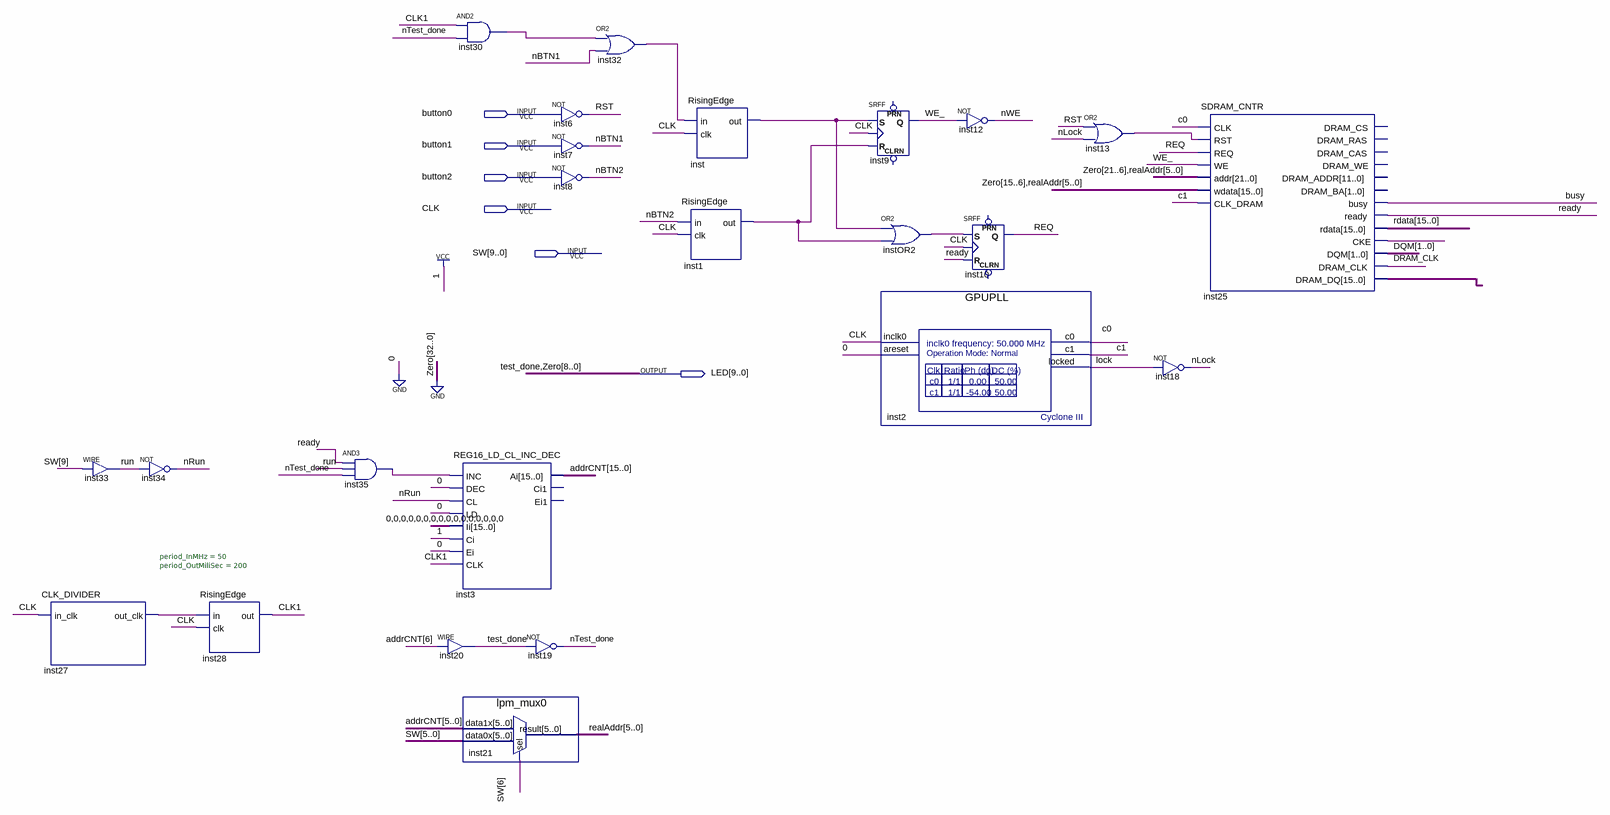
[diagram p0: schematic sheet]
// Quartus schematic sdram_test.bdf as structural Verilog: 24 symbols, 6 pins
module sdram_test (
  input  button0,
  input  button1,
  input  button2,
  input  CLK,
  input  [9:0] SW,
  output [9:0] LED
);

  wire busy, c0, c1, CLK1, DRAM_CLK, inst1_out, inst13_out, inst25_cke, inst27_out_clk, inst30_out,
       inst32_out, inst35_out, inst_out, instOR2_out, lock, nBTN1, nBTN2, nLock, nRun, nTest_done, nWE,
       ready, REQ, RST, run, WE_;
  wire [1:0] DQM;
  wire [5:0] realAddr;
  wire [15:0] addrCNT, inst25_dram_dq, rdata;

  CLK_DIVIDER #(.period_InMHz(50), .period_OutMiliSec(200)) inst27 (.in_clk(CLK), .out_clk(inst27_out_clk));
  assign run = SW[9];  // WIRE inst33
  not inst34 (nRun, run);
  RisingEdge inst28 (.in(inst27_out_clk), .clk(CLK), .out(CLK1));
  and inst35 (inst35_out, ready, run, nTest_done);
  and inst30 (inst30_out, CLK1, nTest_done);
  REG16_LD_CL_INC_DEC inst3 (
    .INC(inst35_out), .DEC(1'b0), .CL(nRun), .LD(1'b0), .Ii({16{1'b0}}), .Ci(1'b1), .Ei(1'b0), .CLK(CLK1),
    .Ai(addrCNT));  // open: Ci1, Ei1
  assign LED[9] = addrCNT[6];  // WIRE inst20
  lpm_mux0 inst21 (.data1x(addrCNT[5:0]), .data0x(SW[5:0]), .sel(SW[6]), .result(realAddr));
  not inst6 (RST, button0);
  not inst7 (nBTN1, button1);
  not inst8 (nBTN2, button2);
  not inst19 (nTest_done, LED[9]);
  or inst32 (inst32_out, inst30_out, nBTN1);
  RisingEdge inst (.in(inst32_out), .clk(CLK), .out(inst_out));
  RisingEdge inst1 (.in(nBTN2), .clk(CLK), .out(inst1_out));
  SRFF inst9 (.S(inst_out), .R(inst1_out), .CLK(CLK), .Q(WE_));  // open: PRN, CLRN
  or instOR2 (instOR2_out, inst_out, inst1_out);
  GPUPLL inst2 (.inclk0(CLK), .areset(1'b0), .c0(c0), .c1(c1), .locked(lock));
  not inst12 (nWE, WE_);
  SRFF inst10 (.S(instOR2_out), .R(ready), .CLK(CLK), .Q(REQ));  // open: PRN, CLRN
  or inst13 (inst13_out, RST, nLock);
  not inst18 (nLock, lock);
  SDRAM_CNTR inst25 (
    .CLK(c0), .RST(inst13_out), .REQ(REQ), .WE(WE_), .addr({{16{1'b0}}, realAddr}),
    .wdata({{10{1'b0}}, realAddr}), .CLK_DRAM(c1), .busy(busy), .ready(ready), .rdata(rdata),
    .CKE(inst25_cke), .DQM(DQM), .DRAM_CLK(DRAM_CLK), .DRAM_DQ(inst25_dram_dq));  // open: DRAM_CS, DRAM_RAS, DRAM_CAS, DRAM_WE, DRAM_ADDR, DRAM_BA

  assign LED[8:0] = {9{1'b0}};

  // Other names for the same wires on the sheet: test_done = LED[9]
endmodule
